# Altium project NBP8 Xilinx Virtex-II Pro BGA456 Rev1.01.PrjPcb
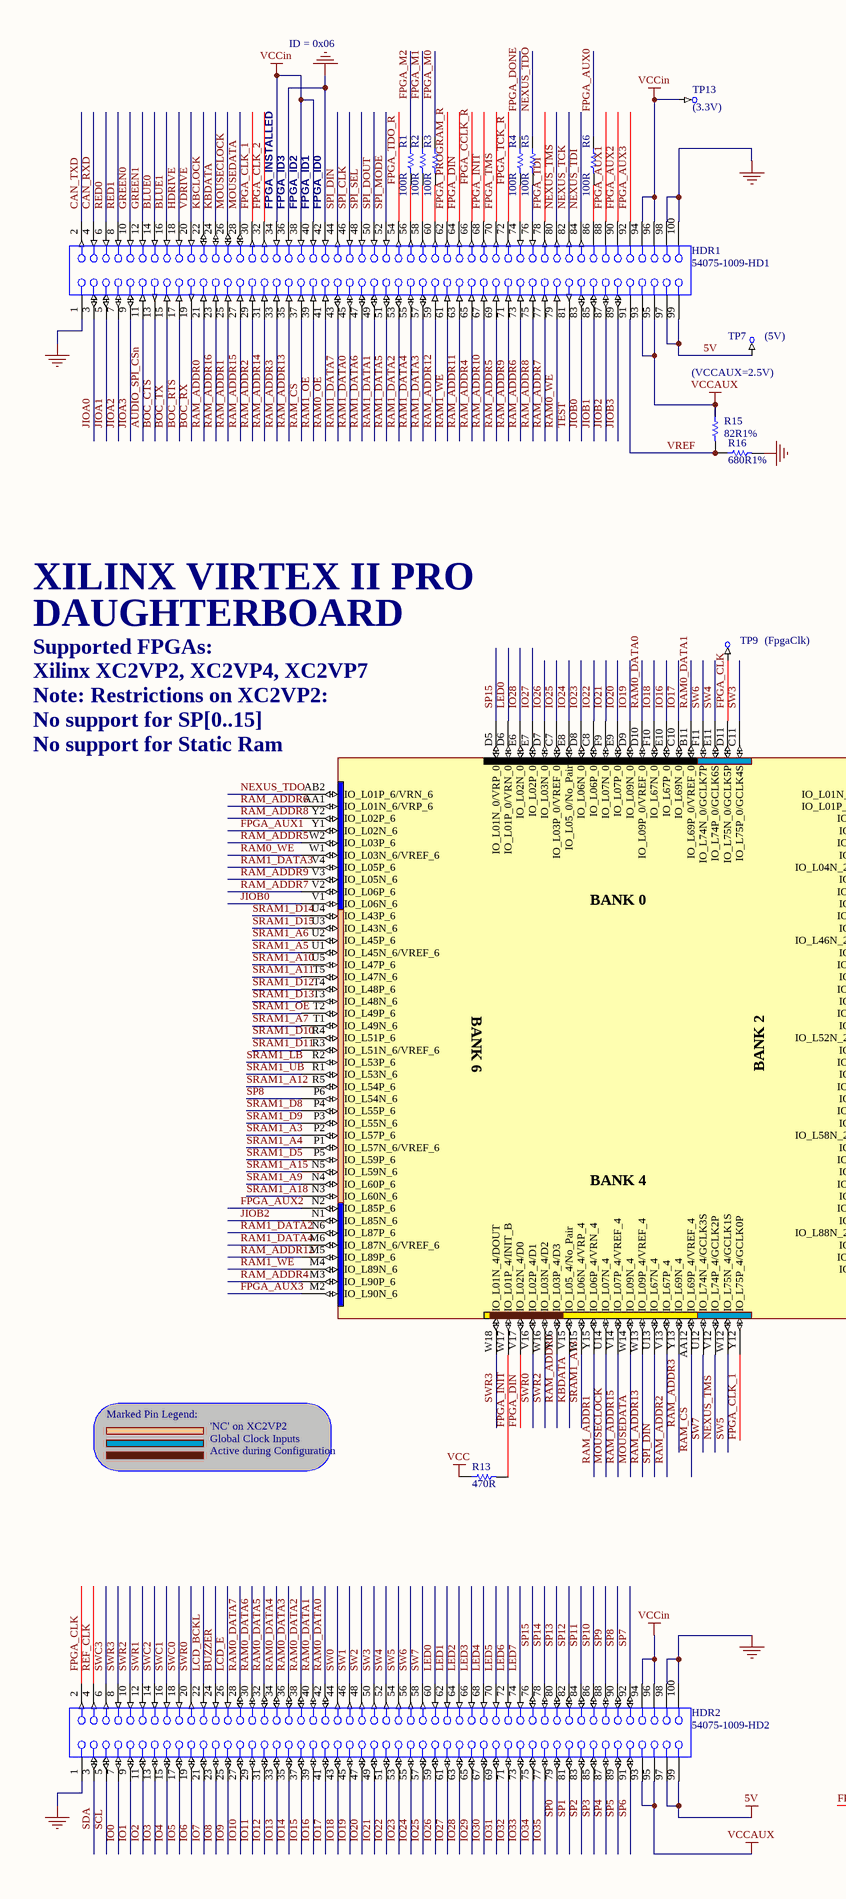
[diagram p0: NBP8 Xilinx Virtex-II Pro BGA456 Rev1.01.SchDoc, left]
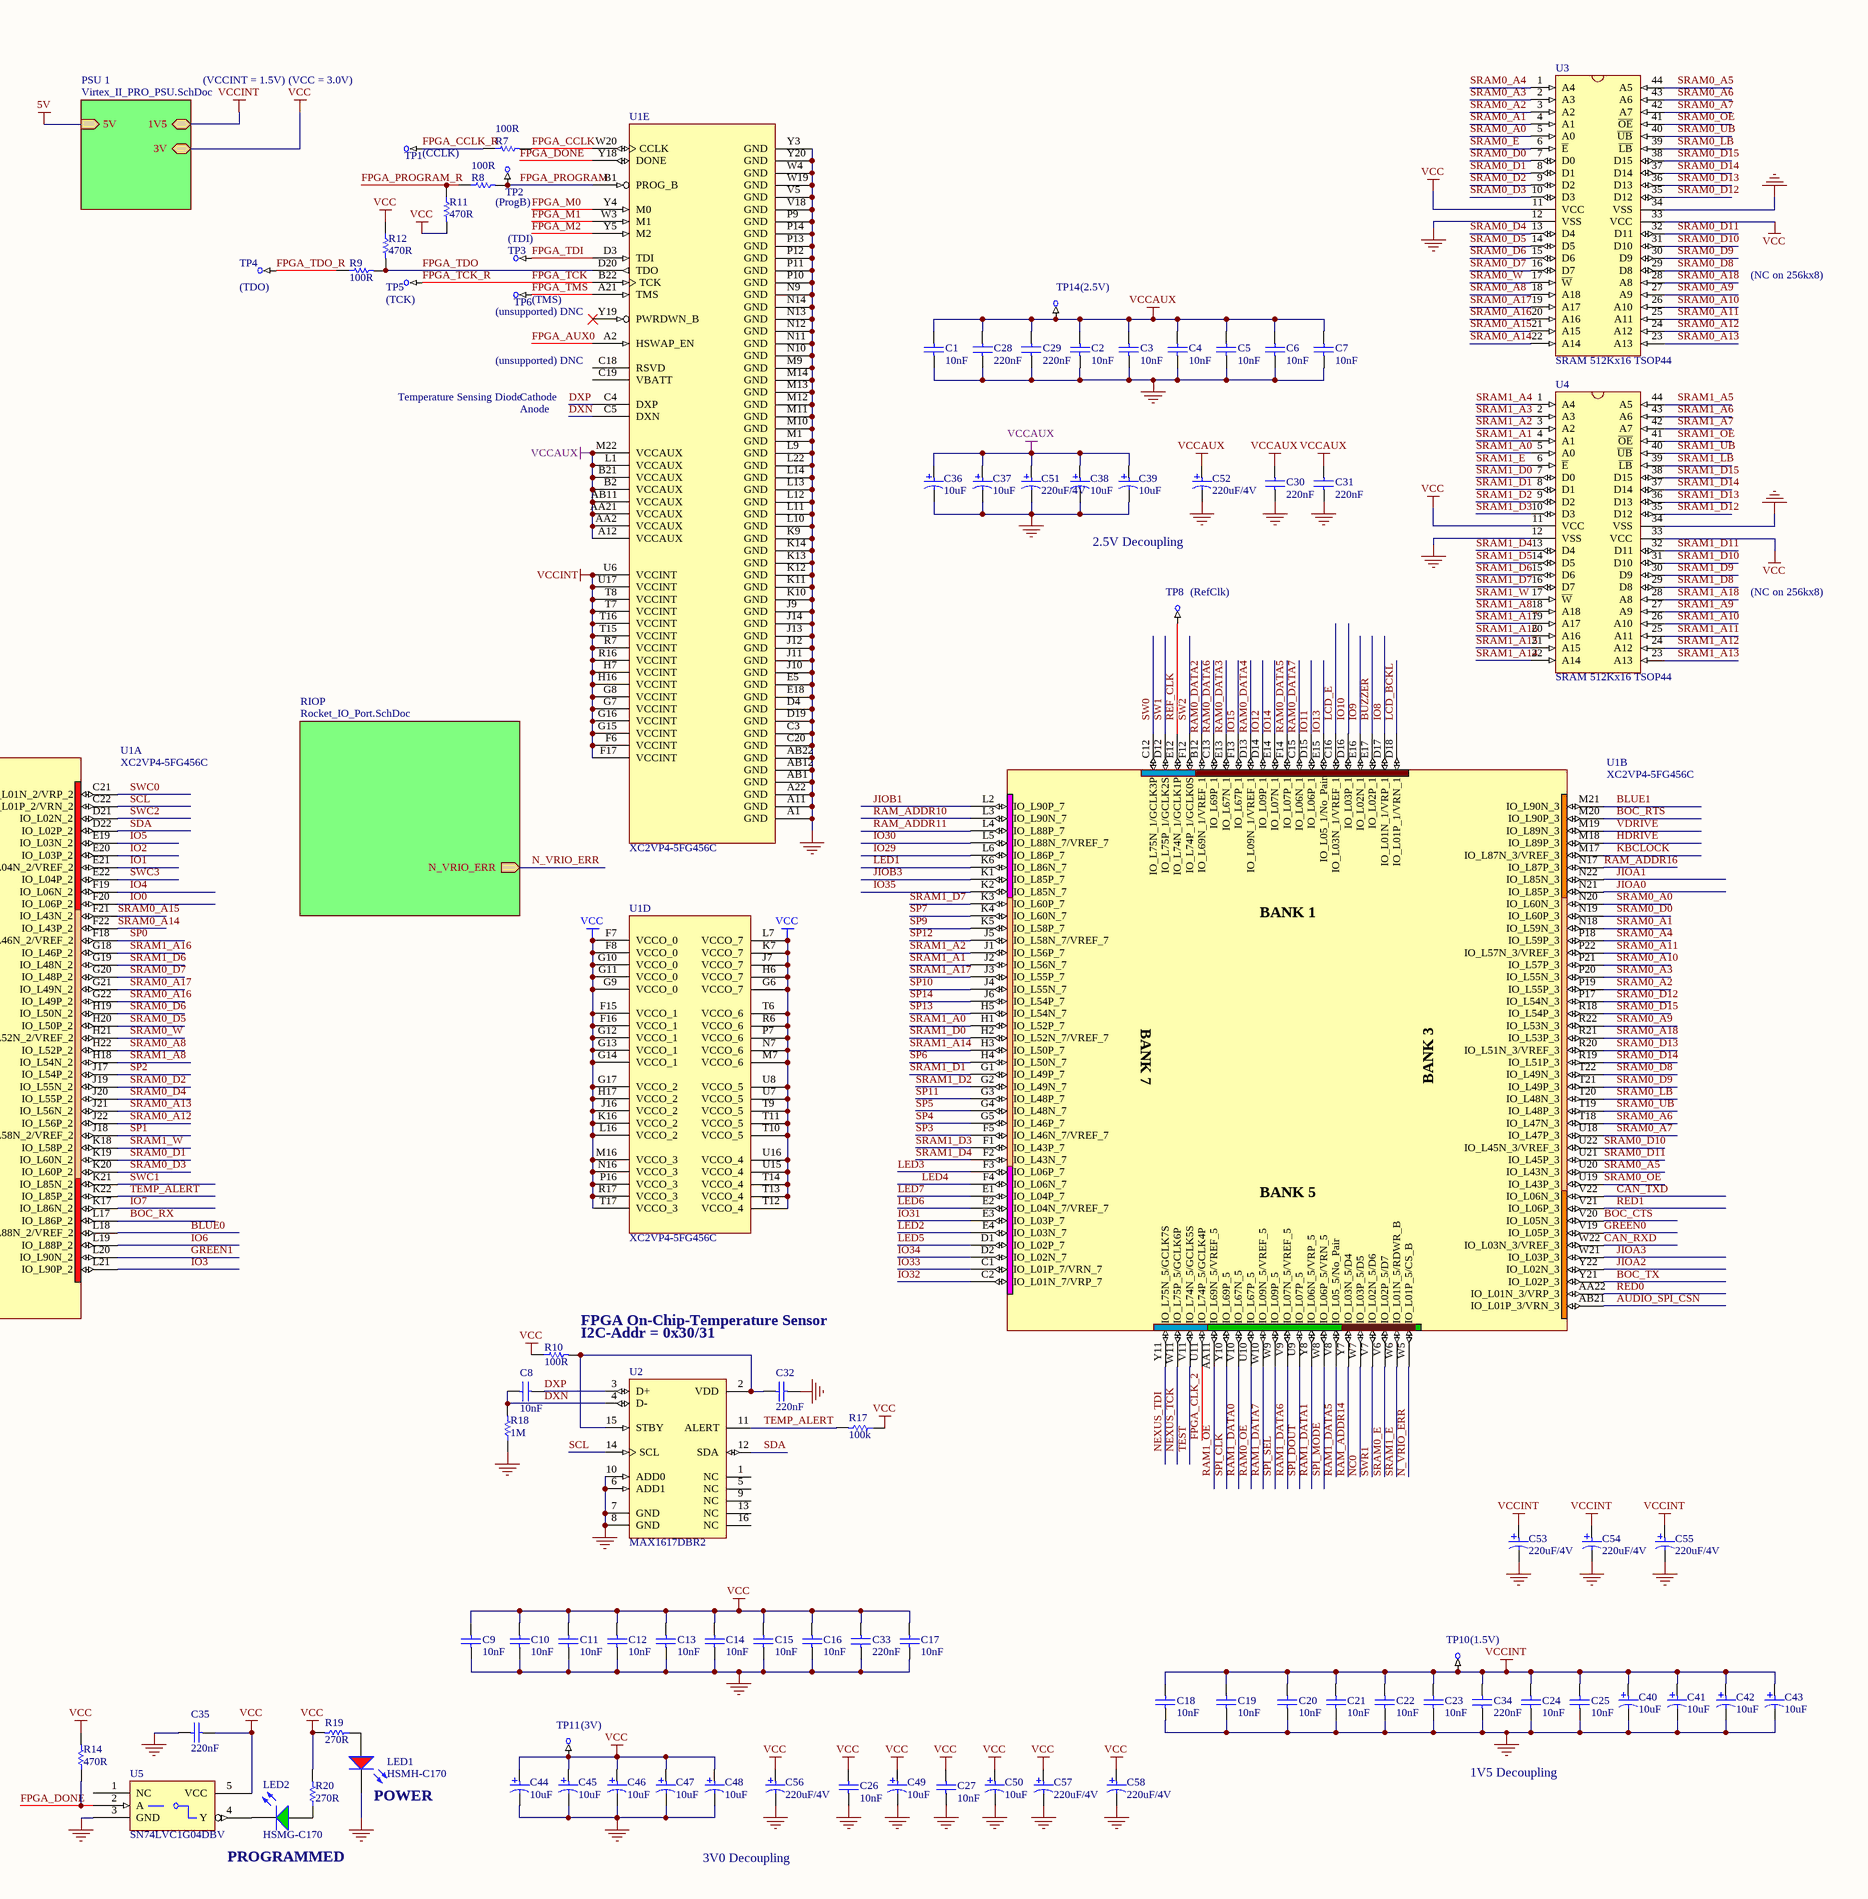
[diagram p1: NBP8 Xilinx Virtex-II Pro BGA456 Rev1.01.SchDoc, right]
2 sheets, 147 parts. Net scope: hierarchical (ports join the sheet entries above them; power ports are global).
Board file: NBP8 Xilinx Virtex-II Pro BGA456 Rev1.01.PcbDoc
Sheets:
  NBP8 Xilinx Virtex-II Pro BGA456 Rev1.01.SchDoc
    RIOP = Rocket_IO_Port.SchDoc

## Sheet NBP8 Xilinx Virtex-II Pro BGA456 Rev1.01.SchDoc
size A2; Organization: Altium Limited; Address1: L3, 12a Rodborough Rd; Address2: Frenchs Forest; Address3: NSW; Address4: Australia 2086; DocumentNumber: 3; Revision: 1.01; SheetNumber: 3; SheetTotal: 3

### Parts
C1  10nF  [CC1608-0603]
C2  10nF  [CC1608-0603]
C3  10nF  [CC1608-0603]
C4  10nF  [CC1608-0603]
C5  10nF  [CC1608-0603]
C6  10nF  [CC1608-0603]
C7  10nF  [CC1608-0603]
C8  10nF  [CC1608-0603]
C9  10nF  [CC1608-0603]
C10  10nF  [CC1608-0603]
C11  10nF  [CC1608-0603]
C12  10nF  [CC1608-0603]
C13  10nF  [CC1608-0603]
C14  10nF  [CC1608-0603]
C15  10nF  [CC1608-0603]
C16  10nF  [CC1608-0603]
C17  10nF  [CC1608-0603]
C18  10nF  [CC1608-0603]
C19  10nF  [CC1608-0603]
C20  10nF  [CC1608-0603]
C21  10nF  [CC1608-0603]
C22  10nF  [CC1608-0603]
C23  10nF  [CC1608-0603]
C24  10nF  [CC1608-0603]
C25  10nF  [CC1608-0603]
C26  10nF  [CC1608-0603]
C27  10nF  [CC1608-0603]
C28  220nF  [CC1608-0603]
C29  220nF  [CC1608-0603]
C30  220nF  [CC1608-0603]
C31  220nF  [CC1608-0603]
C32  220nF  [CC1608-0603]
C33  220nF  [CC1608-0603]
C34  220nF  [CC1608-0603]
C35  220nF  [CC1608-0603]
C36  10uF  [MCCT-B]
C37  10uF  [MCCT-B]
C38  10uF  [MCCT-B]
C39  10uF  [MCCT-B]
C40  10uF  [MCCT-B]
C41  10uF  [MCCT-B]
C42  10uF  [MCCT-B]
C43  10uF  [MCCT-B]
C44  10uF  [MCCT-B]
C45  10uF  [MCCT-B]
C46  10uF  [MCCT-B]
C47  10uF  [MCCT-B]
C48  10uF  [MCCT-B]
C49  10uF  [MCCT-B]
C50  10uF  [MCCT-B]
C51  220uF/4V  [MCCT-D]
C52  220uF/4V  [MCCT-D]
C53  220uF/4V  [MCCT-D]
C54  220uF/4V  [MCCT-D]
C55  220uF/4V  [MCCT-D]
C56  220uF/4V  [MCCT-D]
C57  220uF/4V  [MCCT-D]
C58  220uF/4V  [MCCT-D]
HDR1  54075-1009-HD1  [54075]
HDR2  54075-1009-HD2  [54075]
LED1  HSMH-C170  [SMD _LED]
LED2  HSMG-C170  [SMD _LED]
R1  100R  [CC2012-0805]
R2  100R  [CC2012-0805]
R3  100R  [CC2012-0805]
R4  100R  [CC2012-0805]
R5  100R  [CC2012-0805]
R6  100R  [CC2012-0805]
R7  100R  [CC2012-0805]
R8  100R  [CC2012-0805]
R9  100R  [CC2012-0805]
R10  100R  [CC2012-0805]
R11  470R  [CC2012-0805]
R12  470R  [CC2012-0805]
R13  470R  [CC2012-0805]
R14  470R  [CC2012-0805]
R15  82R1%  [CC2012-0805]
R16  680R1%  [CC2012-0805]
R17  100k  [CC2012-0805]
R18  1M  [CC2012-0805]
R19  270R  [CC2012-0805]
R20  270R  [CC2012-0805]
TP1  (CCLK)  [TestPin]  (no BOM)
TP2  (ProgB)  [TestPin]  (no BOM)
TP3  (TDI)  [TestPin]  (no BOM)
TP4  (TDO)  [TestPin]  (no BOM)
TP5  (TCK)  [TestPin]  (no BOM)
TP6  (TMS)  [TestPin]  (no BOM)
TP7  (5V)  [TestPin]  (no BOM)
TP8  (RefClk)  [TestPin]  (no BOM)
TP9  (FpgaClk)  [TestPin]  (no BOM)
TP10  (1.5V)  [TestPin]  (no BOM)
TP11  (3V)  [TestPin]  (no BOM)
TP13  (3.3V)  [TestPin]  (no BOM)
TP14  (2.5V)  [TestPin]  (no BOM)
U1  XC2VP4-5FG456C  [FG456]  (parts A,B,D,E of 5)
U2  MAX1617DBR2  [QSOP16]
U3  SRAM 512Kx16 TSOP44  [SO-G44/P.8]
U4  SRAM 512Kx16 TSOP44  [SO-G44/P.8]
U5  SN74LVC1G04DBV  [SO-G5/P.95]

### Sub-sheets
PSU 1 = Virtex_II_PRO_PSU.SchDoc (file not in this document): 5V (in), 1V5, 3V
RIOP = Rocket_IO_Port.SchDoc: N_VRIO_ERR (out)

### Nets
5V: HDR1.97 HDR1.99 HDR2.97 HDR2.99 TP7.1 ; sheet PSU 1/5V
GND: C1.2 C2.2 C3.2 C4.2 C5.2 C6.2 C7.2 C9.2 C10.2 C11.2 C12.2 C13.2 C14.2 C15.2 C16.2 C17.2 C18.2 C19.2 C20.2 C21.2 C22.2 C23.2 C24.2 C25.2 C26.2 C27.2 C28.2 C29.2 C30.2 C31.2 C32.1 C33.2 C34.2 C35.2 C36.2 C37.2 C38.2 C39.2 C40.2 C41.2 C42.2 C43.2 C44.2 C45.2 C46.2 C47.2 C48.2 C49.2 C50.2 C51.2 C52.2 C53.2 C54.2 C55.2 C56.2 C57.2 C58.2 HDR1.1 HDR1.36 HDR1.42 HDR1.98 HDR1.100 HDR2.1 HDR2.98 HDR2.100 LED1.2(K) R16.2 R18.1 U1.A1(GND) U1.A11(GND) U1.A22(GND) U1.AB1(GND) U1.AB12(GND) U1.AB22(GND) U1.C3(GND) U1.C20(GND) U1.D4(GND) U1.D19(GND) U1.E5(GND) U1.E18(GND) U1.J9(GND) U1.J10(GND) U1.J11(GND) U1.J12(GND) U1.J13(GND) U1.J14(GND) U1.K9(GND) U1.K10(GND) U1.K11(GND) U1.K12(GND) U1.K13(GND) U1.K14(GND) U1.L9(GND) U1.L10(GND) U1.L11(GND) U1.L12(GND) U1.L13(GND) U1.L14(GND) U1.L22(GND) U1.M1(GND) U1.M9(GND) U1.M10(GND) U1.M11(GND) U1.M12(GND) U1.M13(GND) U1.M14(GND) U1.N9(GND) U1.N10(GND) U1.N11(GND) U1.N12(GND) U1.N13(GND) U1.N14(GND) U1.P9(GND) U1.P10(GND) U1.P11(GND) U1.P12(GND) U1.P13(GND) U1.P14(GND) U1.V5(GND) U1.V18(GND) U1.W4(GND) U1.W19(GND) U1.Y3(GND) U1.Y20(GND) U2.6(ADD1) U2.7(GND) U2.8(GND) U2.10(ADD0) U3.12(VSS) U3.34(VSS) U4.12(VSS) U4.34(VSS) U5.3(GND)
VCC: C9.1 C10.1 C11.1 C12.1 C13.1 C14.1 C15.1 C16.1 C17.1 C26.1 C27.1 C33.1 C35.1 C44.1 C45.1 C46.1 C47.1 C48.1 C49.1 C50.1 C56.1 C57.1 C58.1 R10.1 R11.2 R12.1 R13.1 R14.2 R17.1 R19.2 R20.2 TP11.1 U1.F7(VCCO_0) U1.F8(VCCO_0) U1.F15(VCCO_1) U1.F16(VCCO_1) U1.G6(VCCO_7) U1.G9(VCCO_0) U1.G10(VCCO_0) U1.G11(VCCO_0) U1.G12(VCCO_1) U1.G13(VCCO_1) U1.G14(VCCO_1) U1.G17(VCCO_2) U1.H6(VCCO_7) U1.H17(VCCO_2) U1.J7(VCCO_7) U1.J16(VCCO_2) U1.K7(VCCO_7) U1.K16(VCCO_2) U1.L7(VCCO_7) U1.L16(VCCO_2) U1.M7(VCCO_6) U1.M16(VCCO_3) U1.N7(VCCO_6) U1.N16(VCCO_3) U1.P7(VCCO_6) U1.P16(VCCO_3) U1.R6(VCCO_6) U1.R17(VCCO_3) U1.T6(VCCO_6) U1.T9(VCCO_5) U1.T10(VCCO_5) U1.T11(VCCO_5) U1.T12(VCCO_4) U1.T13(VCCO_4) U1.T14(VCCO_4) U1.T17(VCCO_3) U1.U7(VCCO_5) U1.U8(VCCO_5) U1.U15(VCCO_4) U1.U16(VCCO_4) U3.11(VCC) U3.33(VCC) U4.11(VCC) U4.33(VCC) U5.5(VCC) ; sheet PSU 1/3V
VCCAUX: C1.1 C2.1 C3.1 C4.1 C5.1 C6.1 C7.1 C28.1 C29.1 C30.1 C31.1 C36.1 C37.1 C38.1 C39.1 C51.1 C52.1 HDR1.93 HDR1.95 HDR2.93 HDR2.95 R15.1 TP14.1 U1.A12(VCCAUX) U1.AA2(VCCAUX) U1.AA21(VCCAUX) U1.AB11(VCCAUX) U1.B2(VCCAUX) U1.B21(VCCAUX) U1.L1(VCCAUX) U1.M22(VCCAUX)
VCCin: HDR1.34 HDR1.38 HDR1.40 HDR1.94 HDR1.96 HDR2.94 HDR2.96 TP13.1
VCCINT: C18.1 C19.1 C20.1 C21.1 C22.1 C23.1 C24.1 C25.1 C34.1 C40.1 C41.1 C42.1 C43.1 C53.1 C54.1 C55.1 TP10.1 U1.F6(VCCINT) U1.F17(VCCINT) U1.G7(VCCINT) U1.G8(VCCINT) U1.G15(VCCINT) U1.G16(VCCINT) U1.H7(VCCINT) U1.H16(VCCINT) U1.R7(VCCINT) U1.R16(VCCINT) U1.T7(VCCINT) U1.T8(VCCINT) U1.T15(VCCINT) U1.T16(VCCINT) U1.U6(VCCINT) U1.U17(VCCINT) ; sheet PSU 1/1V5
AUDIO_SPI_CSn: HDR1.11 U1.AB21(IO_L01P_3/VRN_3)
BLUE0: HDR1.14 U1.L18(IO_L88N_2/VREF_2)
BLUE1: HDR1.16 U1.M21(IO_L90N_3)
BOC_CTS: HDR1.13 U1.V20(IO_L05N_3)
BOC_RTS: HDR1.17 U1.M20(IO_L90P_3)
BOC_RX: HDR1.19 U1.L17(IO_L86P_2)
BOC_TX: HDR1.15 U1.Y21(IO_L02P_3)
BUZZER: HDR2.24 U1.E17(IO_L02P_1)
CAN_RXD: HDR1.4 U1.W22(IO_L03N_3/VREF_3)
CAN_TXD: HDR1.2 U1.V22(IO_L06N_3)
DXN: C8.1 R18.2 U1.C5(DXN) U2.4(D-)
DXP: C8.2 U1.C4(DXP) U2.3(D+)
FPGA_AUX0: R6.1 U1.A2(HSWAP_EN)
FPGA_AUX1: HDR1.88 U1.Y1(IO_L02N_6)
FPGA_AUX2: HDR1.90 U1.N2(IO_L85P_6)
FPGA_AUX3: HDR1.92 U1.M2(IO_L90N_6)
FPGA_CCLK: R7.2 U1.W20(CCLK)
FPGA_CCLK_R: HDR1.66 R7.1 TP1.1
FPGA_CLK: HDR2.2 TP9.1 U1.D11(IO_L75N_0/GCLK5P)
FPGA_CLK_1: HDR1.30 U1.Y12(IO_L75P_4/GCLK0P)
FPGA_CLK_2: HDR1.32 U1.U11(IO_L74P_5/GCLK4P)
FPGA_DIN: HDR1.64 U1.V17(IO_L02N_4/D0)
FPGA_DONE: R4.1 R14.1 U1.Y18(DONE) U5.2(A)
FPGA_INIT: HDR1.68 R13.2 U1.W17(IO_L01P_4/INIT_B)
FPGA_M0: R3.1 U1.Y4(M0)
FPGA_M1: R2.1 U1.W3(M1)
FPGA_M2: R1.1 U1.Y5(M2)
FPGA_PROGRAM: R8.2 TP2.1 U1.B1(PROG_B)
FPGA_PROGRAM_R: HDR1.62 R8.1 R11.1
FPGA_TCK: HDR1.72 TP5.1 U1.B22(TCK)  [also labelled FPGA_TCK_R]
FPGA_TDI: HDR1.78 TP3.1 U1.D3(TDI)
FPGA_TDO: R9.2 R12.2 U1.D20(TDO)
FPGA_TDO_R: HDR1.54 R9.1 TP4.1
FPGA_TMS: HDR1.70 TP6.1 U1.A21(TMS)
GREEN0: HDR1.10 U1.V19(IO_L05P_3)
GREEN1: HDR1.12 U1.L20(IO_L90N_2)
HDRIVE: HDR1.18 U1.M18(IO_L89P_3)
IO0: HDR2.7 U1.F20(IO_L06P_2)
IO1: HDR2.9 U1.E21(IO_L04N_2/VREF_2)
IO2: HDR2.11 U1.E20(IO_L03P_2)
IO3: HDR2.13 U1.L21(IO_L90P_2)
IO4: HDR2.15 U1.F19(IO_L06N_2)
IO5: HDR2.17 U1.E19(IO_L03N_2)
IO6: HDR2.19 U1.L19(IO_L88P_2)
IO7: HDR2.21 U1.K17(IO_L86N_2)
IO8: HDR2.23 U1.D17(IO_L01N_1/VRP_1)
IO9: HDR2.25 U1.E16(IO_L02N_1)
IO10: HDR2.27 U1.D16(IO_L03P_1)
IO11: HDR2.29 U1.D15(IO_L06P_1)
IO12: HDR2.31 U1.D14(IO_L09P_1)
IO13: HDR2.33 U1.E15(IO_L05_1/No_Pair)
IO14: HDR2.35 U1.E14(IO_L07N_1)
IO15: HDR2.37 U1.F13(IO_L67P_1)
IO16: HDR2.39 U1.E10(IO_L67P_0)
IO17: HDR2.41 U1.C10(IO_L69N_0)
IO18: HDR2.43 U1.F10(IO_L67N_0)
IO19: HDR2.45 U1.D9(IO_L09N_0)
IO20: HDR2.47 U1.E9(IO_L07P_0)
IO21: HDR2.49 U1.F9(IO_L07N_0)
IO22: HDR2.51 U1.C8(IO_L06P_0)
IO23: HDR2.53 U1.D8(IO_L06N_0)
IO24: HDR2.55 U1.E8(IO_L05_0/No_Pair)
IO25: HDR2.57 U1.C7(IO_L03P_0/VREF_0)
IO26: HDR2.59 U1.D7(IO_L03N_0)
IO27: HDR2.61 U1.E7(IO_L02P_0)
IO28: HDR2.63 U1.E6(IO_L02N_0)
IO29: HDR2.65 U1.L6(IO_L86P_7)
IO30: HDR2.67 U1.L5(IO_L88N_7/VREF_7)
IO31: HDR2.69 U1.E3(IO_L03P_7)
IO32: HDR2.71 U1.C2(IO_L01N_7/VRP_7)
IO33: HDR2.73 U1.C1(IO_L01P_7/VRN_7)
IO34: HDR2.75 U1.D2(IO_L02N_7)
IO35: HDR2.77 U1.K2(IO_L85N_7)
JIOA0: HDR1.3 U1.N21(IO_L85P_3)
JIOA1: HDR1.5 U1.N22(IO_L85N_3)
JIOA2: HDR1.7 U1.Y22(IO_L02N_3)
JIOA3: HDR1.9 U1.W21(IO_L03P_3)
JIOB0: HDR1.83 U1.V1(IO_L06N_6)
JIOB1: HDR1.85 U1.L2(IO_L90P_7)
JIOB2: HDR1.87 U1.N1(IO_L85N_6)
JIOB3: HDR1.89 U1.K1(IO_L85P_7)
KBCLOCK: HDR1.22 U1.M17(IO_L87N_3/VREF_3)
KBDATA: HDR1.24 U1.V15(IO_L05_4/No_Pair)
LCD_BCKL: HDR2.22 U1.D18(IO_L01P_1/VRN_1)
LCD_E: HDR2.26 U1.C16(IO_L03N_1/VREF_1)
LED0: HDR2.60 U1.D6(IO_L01P_0/VRN_0)
LED1: HDR2.62 U1.K6(IO_L86N_7)
LED2: HDR2.64 U1.E4(IO_L03N_7)
LED3: HDR2.66 U1.F3(IO_L06P_7)
LED4: HDR2.68 U1.F4(IO_L06N_7)
LED5: HDR2.70 U1.D1(IO_L02P_7)
LED6: HDR2.72 U1.E2(IO_L04N_7/VREF_7)
LED7: HDR2.74 U1.E1(IO_L04P_7)
MOUSECLOCK: HDR1.26 U1.U14(IO_L07N_4)
MOUSEDATA: HDR1.28 U1.W14(IO_L09N_4)
N_VRIO_ERR: U1.W5(IO_L01P_5/CS_B) ; sheet RIOP/N_VRIO_ERR
NC0: U1.W7(IO_L03P_5/D5)
NEXUS_TCK: HDR1.82 U1.W11(IO_L75P_5/GCLK6P)
NEXUS_TDI: HDR1.84 U1.Y11(IO_L75N_5/GCLK7S)
NEXUS_TDO: R5.1 U1.AB2(IO_L01P_6/VRN_6)
NEXUS_TMS: HDR1.80 U1.V12(IO_L74P_4/GCLK2P)
RAM0_DATA0: HDR2.42 U1.D10(IO_L09P_0/VREF_0)
RAM0_DATA1: HDR2.40 U1.B11(IO_L69P_0/VREF_0)
RAM0_DATA2: HDR2.38 U1.B12(IO_L69N_1/VREF_1)
RAM0_DATA3: HDR2.36 U1.E13(IO_L67N_1)
RAM0_DATA4: HDR2.34 U1.D13(IO_L09N_1/VREF_1)
RAM0_DATA5: HDR2.32 U1.F14(IO_L07P_1)
RAM0_DATA6: HDR2.30 U1.C13(IO_L69P_1)
RAM0_DATA7: HDR2.28 U1.C15(IO_L06N_1)
RAM0_OE: HDR1.41 U1.U10(IO_L67P_5)
RAM0_WE: HDR1.79 U1.W1(IO_L03N_6/VREF_6)
RAM1_DATA0: HDR1.45 U1.V10(IO_L67N_5)
RAM1_DATA1: HDR1.49 U1.Y8(IO_L06N_5/VRP_5)
RAM1_DATA2: HDR1.53 U1.N6(IO_L87P_6)
RAM1_DATA3: HDR1.57 U1.V4(IO_L05P_6)
RAM1_DATA4: HDR1.55 U1.M6(IO_L87N_6/VREF_6)
RAM1_DATA5: HDR1.51 U1.V8(IO_L05_5/No_Pair)
RAM1_DATA6: HDR1.47 U1.V9(IO_L07N_5/VREF_5)
RAM1_DATA7: HDR1.43 U1.W10(IO_L09N_5/VREF_5)
RAM1_OE: HDR1.39 U1.AA11(IO_L69N_5/VREF_5)
RAM1_WE: HDR1.61 U1.M4(IO_L89N_6)
RAM_ADDR0: HDR1.21 U1.Y16(IO_L03P_4/D3)
RAM_ADDR1: HDR1.25 U1.Y15(IO_L06P_4/VRN_4)
RAM_ADDR2: HDR1.29 U1.V13(IO_L67P_4)
RAM_ADDR3: HDR1.33 U1.Y13(IO_L69N_4)
RAM_ADDR4: HDR1.65 U1.M3(IO_L90P_6)
RAM_ADDR5: HDR1.69 U1.W2(IO_L03P_6)
RAM_ADDR6: HDR1.73 U1.AA1(IO_L01N_6/VRP_6)
RAM_ADDR7: HDR1.77 U1.V2(IO_L06P_6)
RAM_ADDR8: HDR1.75 U1.Y2(IO_L02P_6)
RAM_ADDR9: HDR1.71 U1.V3(IO_L05N_6)
RAM_ADDR10: HDR1.67 U1.L3(IO_L90N_7)
RAM_ADDR11: HDR1.63 U1.L4(IO_L88P_7)
RAM_ADDR12: HDR1.59 U1.M5(IO_L89P_6)
RAM_ADDR13: HDR1.35 U1.W13(IO_L09P_4/VREF_4)
RAM_ADDR14: HDR1.31 U1.Y7(IO_L03N_5/D4)
RAM_ADDR15: HDR1.27 U1.V14(IO_L07P_4/VREF_4)
RAM_ADDR16: HDR1.23 U1.N17(IO_L87P_3)
RAM_CS: HDR1.37 U1.AA12(IO_L69P_4/VREF_4)
RED0: HDR1.6 U1.AA22(IO_L01N_3/VRP_3)
RED1: HDR1.8 U1.V21(IO_L06P_3)
REF_CLK: HDR2.4 TP8.1 U1.E12(IO_L74N_1/GCLK1P)
SCL: HDR2.5 U1.C22(IO_L01P_2/VRN_2) U2.14(SCL)
SDA: HDR2.3 U1.D22(IO_L02P_2) U2.12(SDA)
SP0: HDR2.79 U1.F18(IO_L46N_2/VREF_2)
SP1: HDR2.81 U1.J18(IO_L58N_2/VREF_2)
SP2: HDR2.83 U1.J17(IO_L54P_2)
SP3: HDR2.85 U1.F5(IO_L46N_7/VREF_7)
SP4: HDR2.87 U1.G5(IO_L46P_7)
SP5: HDR2.89 U1.G4(IO_L48N_7)
SP6: HDR2.91 U1.H4(IO_L50N_7)
SP7: HDR2.92 U1.K4(IO_L60N_7)
SP8: HDR2.90 U1.P6(IO_L54N_6)
SP9: HDR2.88 U1.K5(IO_L58P_7)
SP10: HDR2.86 U1.J4(IO_L55N_7)
SP11: HDR2.84 U1.G3(IO_L48P_7)
SP12: HDR2.82 U1.J5(IO_L58N_7/VREF_7)
SP13: HDR2.80 U1.H5(IO_L54N_7)
SP14: HDR2.78 U1.J6(IO_L54P_7)
SP15: HDR2.76 U1.D5(IO_L01N_0/VRP_0)
SPI_CLK: HDR1.46 U1.Y10(IO_L69P_5)
SPI_DIN: HDR1.44 U1.U13(IO_L67N_4)
SPI_DOUT: HDR1.50 U1.U9(IO_L07P_5)
SPI_MODE: HDR1.52 U1.W8(IO_L06P_5/VRN_5)
SPI_SEL: HDR1.48 U1.W9(IO_L09P_5)
SRAM0_A0: U1.N20(IO_L60N_3) U3.5(A0)
SRAM0_A1: U1.N18(IO_L59N_3) U3.4(A1)
SRAM0_A2: U1.P19(IO_L55P_3) U3.3(A2)
SRAM0_A3: U1.P20(IO_L55N_3) U3.2(A3)
SRAM0_A4: U1.P18(IO_L59P_3) U3.1(A4)
SRAM0_A5: U1.U20(IO_L43N_3) U3.44(A5)
SRAM0_A6: U1.T18(IO_L47N_3) U3.43(A6)
SRAM0_A7: U1.U18(IO_L47P_3) U3.42(A7)
SRAM0_A8: U1.H22(IO_L52P_2) U3.18(A18)
SRAM0_A9: U1.R22(IO_L53N_3) U3.27(A9)
SRAM0_A10: U1.P21(IO_L57P_3) U3.26(A10)
SRAM0_A11: U1.P22(IO_L57N_3/VREF_3) U3.25(A11)
SRAM0_A12: U1.J22(IO_L56P_2) U3.24(A12)
SRAM0_A13: U1.J21(IO_L56N_2) U3.23(A13)
SRAM0_A14: U1.F22(IO_L43P_2) U3.22(A14)
SRAM0_A15: U1.F21(IO_L43N_2) U3.21(A15)
SRAM0_A16: U1.G22(IO_L49P_2) U3.20(A16)
SRAM0_A17: U1.G21(IO_L49N_2) U3.19(A17)
SRAM0_A18: U1.R21(IO_L53P_3) U3.28(A8)
SRAM0_D0: U1.N19(IO_L60P_3) U3.7(D0)
SRAM0_D1: U1.K19(IO_L60N_2) U3.8(D1)
SRAM0_D2: U1.J19(IO_L55N_2) U3.9(D2)
SRAM0_D3: U1.K20(IO_L60P_2) U3.10(D3)
SRAM0_D4: U1.J20(IO_L55P_2) U3.13(D4)
SRAM0_D5: U1.H20(IO_L50P_2) U3.14(D5)
SRAM0_D6: U1.H19(IO_L50N_2) U3.15(D6)
SRAM0_D7: U1.G20(IO_L48P_2) U3.16(D7)
SRAM0_D8: U1.T22(IO_L49N_3) U3.29(D8)
SRAM0_D9: U1.T21(IO_L49P_3) U3.30(D9)
SRAM0_D10: U1.U22(IO_L45N_3/VREF_3) U3.31(D10)
SRAM0_D11: U1.U21(IO_L45P_3) U3.32(D11)
SRAM0_D12: U1.P17(IO_L54N_3) U3.35(D12)
SRAM0_D13: U1.R20(IO_L51N_3/VREF_3) U3.36(D13)
SRAM0_D14: U1.R19(IO_L51P_3) U3.37(D14)
SRAM0_D15: U1.R18(IO_L54P_3) U3.38(D15)
SRAM0_E: U1.V6(IO_L02P_5/D7) U3.6(~{E})
SRAM0_LB: U1.T20(IO_L48N_3) U3.39(~{LB})
SRAM0_OE: U1.U19(IO_L43P_3) U3.41(~{OE})
SRAM0_UB: U1.T19(IO_L48P_3) U3.40(~{UB})
SRAM0_W: U1.H21(IO_L52N_2/VREF_2) U3.17(~{W})
SRAM1_A0: U1.H1(IO_L52P_7) U4.5(A0)
SRAM1_A1: U1.J2(IO_L56N_7) U4.4(A1)
SRAM1_A2: U1.J1(IO_L56P_7) U4.3(A2)
SRAM1_A3: U1.P2(IO_L57P_6) U4.2(A3)
SRAM1_A4: U1.P1(IO_L57N_6/VREF_6) U4.1(A4)
SRAM1_A5: U1.U1(IO_L45N_6/VREF_6) U4.44(A5)
SRAM1_A6: U1.U2(IO_L45P_6) U4.43(A6)
SRAM1_A7: U1.T1(IO_L49N_6) U4.42(A7)
SRAM1_A8: U1.H18(IO_L54N_2) U4.18(A18)
SRAM1_A9: U1.N4(IO_L60P_6) U4.27(A9)
SRAM1_A10: U1.U5(IO_L47P_6) U4.26(A10)
SRAM1_A11: U1.T5(IO_L47N_6) U4.25(A11)
SRAM1_A12: U1.R5(IO_L54P_6) U4.24(A12)
SRAM1_A13: U1.W15(IO_L06N_4/VRP_4) U4.23(A13)
SRAM1_A14: U1.H3(IO_L50P_7) U4.22(A14)
SRAM1_A15: U1.N5(IO_L59N_6) U4.21(A15)
SRAM1_A16: U1.G18(IO_L46P_2) U4.20(A16)
SRAM1_A17: U1.J3(IO_L55P_7) U4.19(A17)
SRAM1_A18: U1.N3(IO_L60N_6) U4.28(A8)
SRAM1_D0: U1.H2(IO_L52N_7/VREF_7) U4.7(D0)
SRAM1_D1: U1.G1(IO_L49P_7) U4.8(D1)
SRAM1_D2: U1.G2(IO_L49N_7) U4.9(D2)
SRAM1_D3: U1.F1(IO_L43P_7) U4.10(D3)
SRAM1_D4: U1.F2(IO_L43N_7) U4.13(D4)
SRAM1_D5: U1.P5(IO_L59P_6) U4.14(D5)
SRAM1_D6: U1.G19(IO_L48N_2) U4.15(D6)
SRAM1_D7: U1.K3(IO_L60P_7) U4.16(D7)
SRAM1_D8: U1.P4(IO_L55P_6) U4.29(D8)
SRAM1_D9: U1.P3(IO_L55N_6) U4.30(D9)
SRAM1_D10: U1.R4(IO_L51P_6) U4.31(D10)
SRAM1_D11: U1.R3(IO_L51N_6/VREF_6) U4.32(D11)
SRAM1_D12: U1.T4(IO_L48P_6) U4.35(D12)
SRAM1_D13: U1.T3(IO_L48N_6) U4.36(D13)
SRAM1_D14: U1.U4(IO_L43P_6) U4.37(D14)
SRAM1_D15: U1.U3(IO_L43N_6) U4.38(D15)
SRAM1_E: U1.W6(IO_L01N_5/RDWR_B) U4.6(~{E})
SRAM1_LB: U1.R2(IO_L53P_6) U4.39(~{LB})
SRAM1_OE: U1.T2(IO_L49P_6) U4.41(~{OE})
SRAM1_UB: U1.R1(IO_L53N_6) U4.40(~{UB})
SRAM1_W: U1.K18(IO_L58P_2) U4.17(~{W})
SW0: HDR2.44 U1.C12(IO_L75N_1/GCLK3P)
SW1: HDR2.46 U1.D12(IO_L75P_1/GCLK2S)
SW2: HDR2.48 U1.F12(IO_L74P_1/GCLK0S)
SW3: HDR2.50 U1.C11(IO_L75P_0/GCLK4S)
SW4: HDR2.52 U1.E11(IO_L74P_0/GCLK6S)
SW5: HDR2.54 U1.W12(IO_L75N_4/GCLK1S)
SW6: HDR2.56 U1.F11(IO_L74N_0/GCLK7P)
SW7: HDR2.58 U1.U12(IO_L74N_4/GCLK3S)
SWC0: HDR2.18 U1.C21(IO_L01N_2/VRP_2)
SWC1: HDR2.16 U1.K21(IO_L85N_2)
SWC2: HDR2.14 U1.D21(IO_L02N_2)
SWC3: HDR2.6 U1.E22(IO_L04P_2)
SWR0: HDR2.20 U1.V16(IO_L02P_4/D1)
SWR1: HDR2.12 U1.V7(IO_L02N_5/D6)
SWR2: HDR2.10 U1.W16(IO_L03N_4/D2)
SWR3: HDR2.8 U1.W18(IO_L01N_4/DOUT)
TEMP_ALERT: R17.2 U1.K22(IO_L85P_2) U2.11(ALERT)
TEST: HDR1.81 U1.V11(IO_L74N_5/GCLK5S)
VDRIVE: HDR1.20 U1.M19(IO_L89N_3)
VREF: HDR1.91 R15.2 R16.1
NetC32_2: C32.2 R10.2 U2.2(VDD) U2.15(STBY)
NetHDR1_56: HDR1.56 R1.2
NetHDR1_58: HDR1.58 R2.2
NetHDR1_60: HDR1.60 R3.2
NetHDR1_74: HDR1.74 R4.2
NetHDR1_76: HDR1.76 R5.2
NetHDR1_86: HDR1.86 R6.2
NetLED1_1: LED1.1(A) R19.1
NetLED2_1: LED2.1(A) R20.1
NetLED2_2: LED2.2(K) U5.4(Y)

Not connected (* = marked no-connect by the designer): U1 C18(RSVD) C19(VBATT) Y19(PWRDWN_B)*; U2 1(NC) 5(NC) 9(NC) 13(NC) 16(NC); U5 1(NC)

### Notes on the sheet
- ID = 0x06
- (VCCINT = 1.5V)
- (VCC = 3.0V)
- (near HDR1) FPGA_INSTALLED
- (near HDR1) FPGA_ID3
- (near HDR1) FPGA_ID2
- (near HDR1) FPGA_ID1
- (near HDR1) FPGA_ID0
- (NC on 256kx8)
- (near TP6) (unsupported) DNC
- (VCCAUX=2.5V)
- Temperature Sensing Diode
- (unsupported) DNC
- Anode
- Cathode
- XILINX VIRTEX II PRO
- 2.5V Decoupling
- DAUGHTERBOARD
- Supported FPGAs:
- Xilinx XC2VP2, XC2VP4, XC2VP7
- Note: Restrictions on XC2VP2:
- (near U1) No support for SP[0..15]
- (near U1) No support for Static Ram
- (near R10) FPGA On-Chip-Temperature Sensor
- (near R10) I2C-Addr = 0x30/31
- Marked Pin Legend:
- 'NC' on XC2VP2
- Global Clock Inputs
- Active during Configuration
- (near LED1) POWER
- 1V5 Decoupling
- PROGRAMMED
- 3V0 Decoupling
- Title
- Size:
- Date:
- File:
- A2
- Number:
- Time:
- Revision:
- Sheet
- of
- (in symbol XC2VP4-5FG456C, part A) BANK 0; BANK 6; BANK 2; BANK 4
- (in symbol XC2VP4-5FG456C, part B) BANK 1; BANK 7; BANK 3; BANK 5

### Library data of the parts
C1-C35 = CAP: Capacitor; Supplier: FARNELL
  C1-C27: Supplier Code: 772-236
  C28-C35: Supplier Code: 335-2020
C36-C58 = CAP_POLAR: Polar Capacitor; Supplier: FARNELL
  C36-C50: Supplier Code: 967-117
  C51-C58: Supplier Code: 355-1829
HDR1 = 54075-1009-HD1: Board-to-Board, Docking Station, 0.80mm (.031") Pitch, Shielded Receptacle, Vertical, Ultra Low Profile, SMT; Manufacturer: Molex; Package Information: Latest Revision: Jun-2001; Mating Height: 8.5mm; Voltage: 100V; Current: 0.5A; Contact Resistance: 40mOhm max; PCB Layout: Complies with Manufacturer's Recommendation.; Published: 15-Oct-2003; Datasheet: Latest Revision: Feb-2002; Package Reference: 54075; Publisher: Altium Limited
HDR2 = 54075-1009-HD2: Board-to-Board, Docking Station, 0.80mm (.031") Pitch, Shielded Receptacle, Vertical, Ultra Low Profile, SMT; Manufacturer: Molex; Package Information: Latest Revision: Jun-2001; Mating Height: 8.5mm; Voltage: 100V; Current: 0.5A; Contact Resistance: 40mOhm max; PCB Layout: Complies with Manufacturer's Recommendation.; Published: 15-Oct-2003; Datasheet: Latest Revision: Feb-2002; Package Reference: 54075; Publisher: Altium Limited
LED1 = HSMX-C670: Typical RED GaAs SMD LED Agilent make; Manufacturer: Generic Components; Class I: Optoelectronic; Fitted: True; Published: 8-Jun-2000; Revision: July-2002: Re-released for DXP Platform.; Publisher: Altium Limited; Class II: LED
LED2 = HSMX-C670: Typical GREEN GaAs SMD LED Agilent make; Manufacturer: Generic Components; Class I: Optoelectronic; Fitted: True; Published: 8-Jun-2000; Revision: July-2002: Re-released for DXP Platform.; Publisher: Altium Limited; Class II: LED
R1-R20 = RES: Resistor
TP1-TP11 TP13 TP14 = TestPin
U1 = XC2VP4-5FG456C: Virtex-II Pro Platform FPGA, 456-Ball FBGA, Speed Grade 5, 248 User I/Os, Commercial Grade; Manufacturer Recommendation: Solder pad diameter 0.45mm SMD; Package Information: Latest Revision: ver1.1, Apr-2001; User I/Os: 248 Available; Code - JEDEC: MO-151-AAJ-1; Published: 17-Jul-2002; Revision: 16-Apr-2003: Minor layout changes, TXN/TXP Pins changed from 'Output' to 'HiZ'.  'PROG_B' pin types changed from IO to Input.; Datasheet: Latest Revision: 10-Dec-2003; Package Reference: FG456; Publisher: Altium Limited
U2 = MAX1617DBR2: SMBus Temperature Sensor with Internal and External Diode Input; Package Information: Latest Revision: Feb-2000; Published: 17-Jul-2002; Datasheet: Latest Revision: Feb-2000; Package Reference: QSOP16; Publisher: Altium Limited; Supplier: FARNELL; Supplier Code: 301-2682
U3 U4 = SRAM 512Kx16 TSOP44: 512Kx16Bit SRAM TSOP44; Supplier: IDT; Supplier Code: 71V416L10PH
U5 = SN74AHC1G04DBVR: Manufacturer: TI; Fitted: True

## Sheet Rocket_IO_Port.SchDoc
size A4; Organization: Altium Limited; Address1: L3, 12a Rodborough Rd; Address2: Frenchs Forest; Address3: NSW; Address4: Australia 2086; DocumentNumber: 2; Revision: 1.01; SheetNumber: 2; SheetTotal: 3
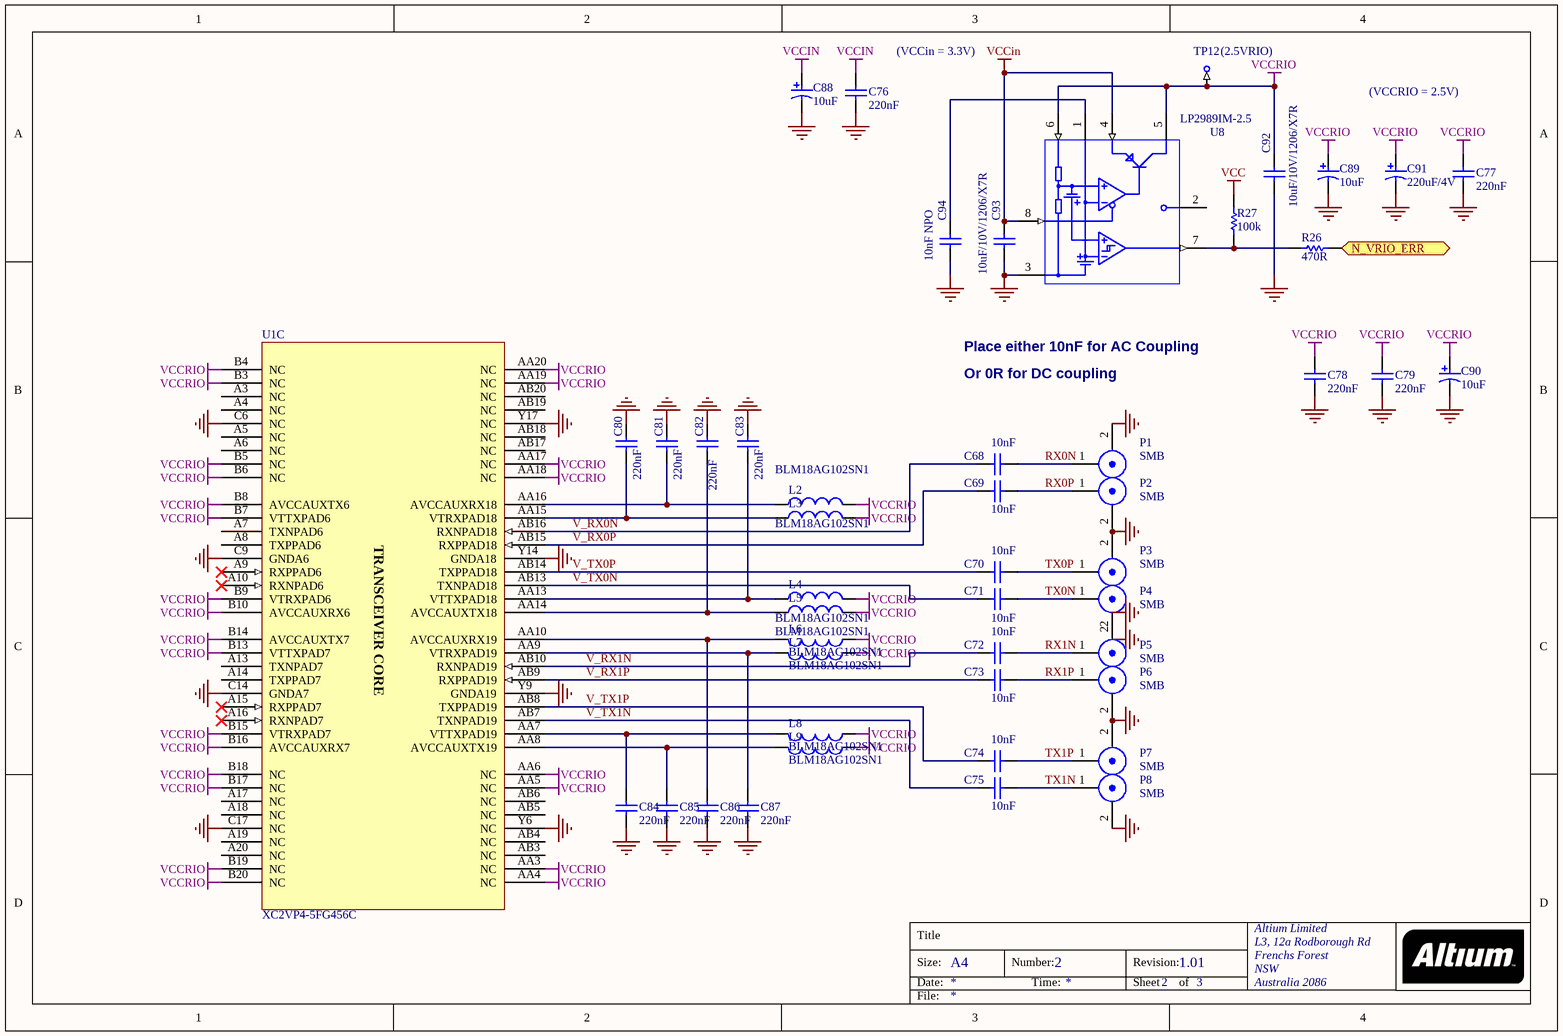
[diagram p2: Rocket_IO_Port.SchDoc]

### Parts
C68  10nF  [CC1005-0402]
C69  10nF  [CC1005-0402]
C70  10nF  [CC1005-0402]
C71  10nF  [CC1005-0402]
C72  10nF  [CC1005-0402]
C73  10nF  [CC1005-0402]
C74  10nF  [CC1005-0402]
C75  10nF  [CC1005-0402]
C76  220nF  [CC1608-0603]
C77  220nF  [CC1608-0603]
C78  220nF  [CC1608-0603]
C79  220nF  [CC1608-0603]
C80  220nF  [CC1608-0603]
C81  220nF  [CC1608-0603]
C82  220nF  [CC1608-0603]
C83  220nF  [CC1608-0603]
C84  220nF  [CC1608-0603]
C85  220nF  [CC1608-0603]
C86  220nF  [CC1608-0603]
C87  220nF  [CC1608-0603]
C88  10uF  [MCCT-B]
C89  10uF  [MCCT-B]
C90  10uF  [MCCT-B]
C91  220uF/4V  [MCCT-D]
C92  10uF/10V/1206/X7R  [CC3216-1206]
C93  10uF/10V/1206/X7R  [CC3216-1206]
C94  10nF NPO  [CC3216-1206]
L2  value BLM18AG102SN1  [CC1608-0603]  (hidden comment: Inductor)
L3  value BLM18AG102SN1  [CC1608-0603]  (hidden comment: Inductor)
L4  value BLM18AG102SN1  [CC1608-0603]  (hidden comment: Inductor)
L5  value BLM18AG102SN1  [CC1608-0603]  (hidden comment: Inductor)
L6  value BLM18AG102SN1  [CC1608-0603]  (hidden comment: Inductor)
L7  value BLM18AG102SN1  [CC1608-0603]  (hidden comment: Inductor)
L8  value BLM18AG102SN1  [CC1608-0603]  (hidden comment: Inductor)
L9  value BLM18AG102SN1  [CC1608-0603]  (hidden comment: Inductor)
P1  SMB  [SMB_V-RJ45]
P2  SMB  [SMB_V-RJ45]
P3  SMB  [SMB_V-RJ45]
P4  SMB  [SMB_V-RJ45]
P5  SMB  [SMB_V-RJ45]
P6  SMB  [SMB_V-RJ45]
P7  SMB  [SMB_V-RJ45]
P8  SMB  [SMB_V-RJ45]
R26  470R  [CC2012-0805]
R27  100k  [CC2012-0805]
TP12  (2.5VRIO)  [TestPin]  (no BOM)
U1  XC2VP4-5FG456C  [FG456]  (part C of 5)
U8  LP2989IM-2.5  [SO-8]

### Ports
N_VRIO_ERR (out)

### Nets
GND: C76.2 C77.2 C78.2 C79.2 C80.1 C81.1 C82.1 C83.1 C84.1 C85.1 C86.1 C87.1 C88.2 C89.2 C90.2 C91.2 C92.1 C93.1 C94.2 P1.2(Y) P2.2(Y) P3.2(Y) P4.2(Y) P5.2(Y) P6.2(Y) P7.2(Y) P8.2(Y) U1.C6(NC) U1.C9(GNDA6) U1.C14(GNDA7) U1.C17(NC) U1.Y6(NC) U1.Y9(GNDA19) U1.Y14(GNDA18) U1.Y17(NC) U8.3(GND)
VCC: R27.2
VCCin: C76.1 C88.1 C93.2 U8.4(INPUT) U8.8(S~{/}/D/)
VCCRIO: C77.1 C78.1 C79.1 C89.1 C90.1 C91.1 C92.2 L2.2 L3.2 L4.2 L5.2 L6.2 L7.2 L8.2 L9.2 TP12.1 U1.AA3(NC) U1.AA4(NC) U1.AA5(NC) U1.AA6(NC) U1.AA17(NC) U1.AA18(NC) U1.AA19(NC) U1.AA20(NC) U1.B3(NC) U1.B4(NC) U1.B5(NC) U1.B6(NC) U1.B7(VTTXPAD6) U1.B8(AVCCAUXTX6) U1.B9(VTRXPAD6) U1.B10(AVCCAUXRX6) U1.B13(VTTXPAD7) U1.B14(AVCCAUXTX7) U1.B15(VTRXPAD7) U1.B16(AVCCAUXRX7) U1.B17(NC) U1.B18(NC) U1.B19(NC) U1.B20(NC) U8.5(OUTPUT) U8.6(SENSE)
N_VRIO_ERR: R26.2 ; port N_VRIO_ERR
RX0N: C68.2 P1.1(X)
RX0P: C69.2 P2.1(X)
RX1N: C72.2 P5.1(X)
RX1P: C73.2 P6.1(X)
TX0N: C71.2 P4.1(X)
TX0P: C70.2 P3.1(X)
TX1N: C75.2 P8.1(X)
TX1P: C74.2 P7.1(X)
V_RX0N: C68.1 U1.AB16(RXNPAD18)
V_RX0P: C69.1 U1.AB15(RXPPAD18)
V_RX1N: C72.1 U1.AB10(RXNPAD19)
V_RX1P: C73.1 U1.AB9(RXPPAD19)
V_TX0N: C71.1 U1.AB13(TXNPAD18)
V_TX0P: C70.1 U1.AB14(TXPPAD18)
V_TX1N: C75.1 U1.AB7(TXNPAD19)
V_TX1P: C74.1 U1.AB8(TXPPAD19)
NetC80_2: C80.2 L3.1 U1.AA15(VTRXPAD18)
NetC81_2: C81.2 L2.1 U1.AA16(AVCCAUXRX18)
NetC82_2: C82.2 L5.1 U1.AA14(AVCCAUXTX18)
NetC83_2: C83.2 L4.1 U1.AA13(VTTXPAD18)
NetC84_2: C84.2 L8.1 U1.AA7(VTTXPAD19)
NetC85_2: C85.2 L9.1 U1.AA8(AVCCAUXTX19)
NetC86_2: C86.2 L6.1 U1.AA10(AVCCAUXRX19)
NetC87_2: C87.2 L7.1 U1.AA9(VTRXPAD19)
NetC94_1: C94.1 U8.1(BYPASS)
NetR26_1: R26.1 R27.1 U8.7(~{ERROR})

Not connected (* = marked no-connect by the designer): U1 A3(NC) A4(NC) A5(NC) A6(NC) A7(TXNPAD6) A8(TXPPAD6) A9(RXPPAD6)* A10(RXNPAD6)* A13(TXNPAD7) A14(TXPPAD7) A15(RXPPAD7)* A16(RXNPAD7)* A17(NC) A18(NC) A19(NC) A20(NC) AB3(NC) AB4(NC) AB5(NC) AB6(NC) AB17(NC) AB18(NC) AB19(NC) AB20(NC); U8 2(N/C)

### Notes on the sheet
- (near C76) (VCCin = 3.3V)
- (VCCRIO = 2.5V)
- Place either 10nF for AC Coupling
- Or 0R for DC coupling
- Title
- Size:
- Date:
- A4
- Number:
- Time:
- Revision:
- Sheet
- of
- File:
- (in symbol XC2VP4-5FG456C, part C) TRANSCEIVER CORE

### Library data of the parts
C68-C87 C92-C94 = CAP: Capacitor
  C68-C75: Supplier: FARNELL; Supplier Code: 578-149
  C76-C87: Supplier: FARNELL; Supplier Code: 335-2020
  C92 C93: Supplier: RS; Supplier Code: 367-3437
  C94: Supplier: FARNELL; Supplier Code: 578-320
C88-C91 = CAP_POLAR: Polar Capacitor; Supplier: FARNELL
  C88-C90: Supplier Code: 967-117
  C91: Supplier Code: 355-1829
P1-P8 = SMB: SMB Straight Connector; Revision: 17-Jul-2002: Re-released for DXP Platform.; Publisher: Altium Limited; Supplier: FARNELL; Supplier Code: 410-8073
R26 R27 = RES: Resistor
TP12 = TestPin
U1 = XC2VP4-5FG456C: as U1 on sheet NBP8 Xilinx Virtex-II Pro BGA456 Rev1.01; Published: 17-Jul-2002; Revision: 16-Apr-2003: Minor layout changes, TXN/TXP Pins changed from 'Output' to 'HiZ'.  'PROG_B' pin types changed from IO to Input.; Datasheet: Latest Revision: 10-Dec-2003; Package Reference: FG456; Publisher: Altium Limited
U8 = LP2989: NS Micropower/Low Noise 500mA LDO; Supplier: FARNELL; Supplier Code: 360-6478
L2-L9 = Inductor: Published: 8-Jun-2000; Revision: July-2002: Re-released for DXP Platform.; Publisher: Altium Limited; Supplier: Murata; Supplier Code: BLM18AG102SN1

## Nets that join several sheets
GND: NBP8 Xilinx Virtex-II Pro BGA456 Rev1.01 (133 pins), Rocket_IO_Port (36 pins)
VCC: NBP8 Xilinx Virtex-II Pro BGA456 Rev1.01 (77 pins), Rocket_IO_Port (R27.2)
VCCin: NBP8 Xilinx Virtex-II Pro BGA456 Rev1.01 (8 pins), Rocket_IO_Port (5 pins)
N_VRIO_ERR: NBP8 Xilinx Virtex-II Pro BGA456 Rev1.01 (U1.W5), Rocket_IO_Port (R26.2)